# EasyEDA schematic G1000_Buttons_Right.json
TITLE: Sheet_1; REV: 1.0; Date: 2024-03-31; Sheet: 1/1; Drawn By: gagagu1; Company: Your Company
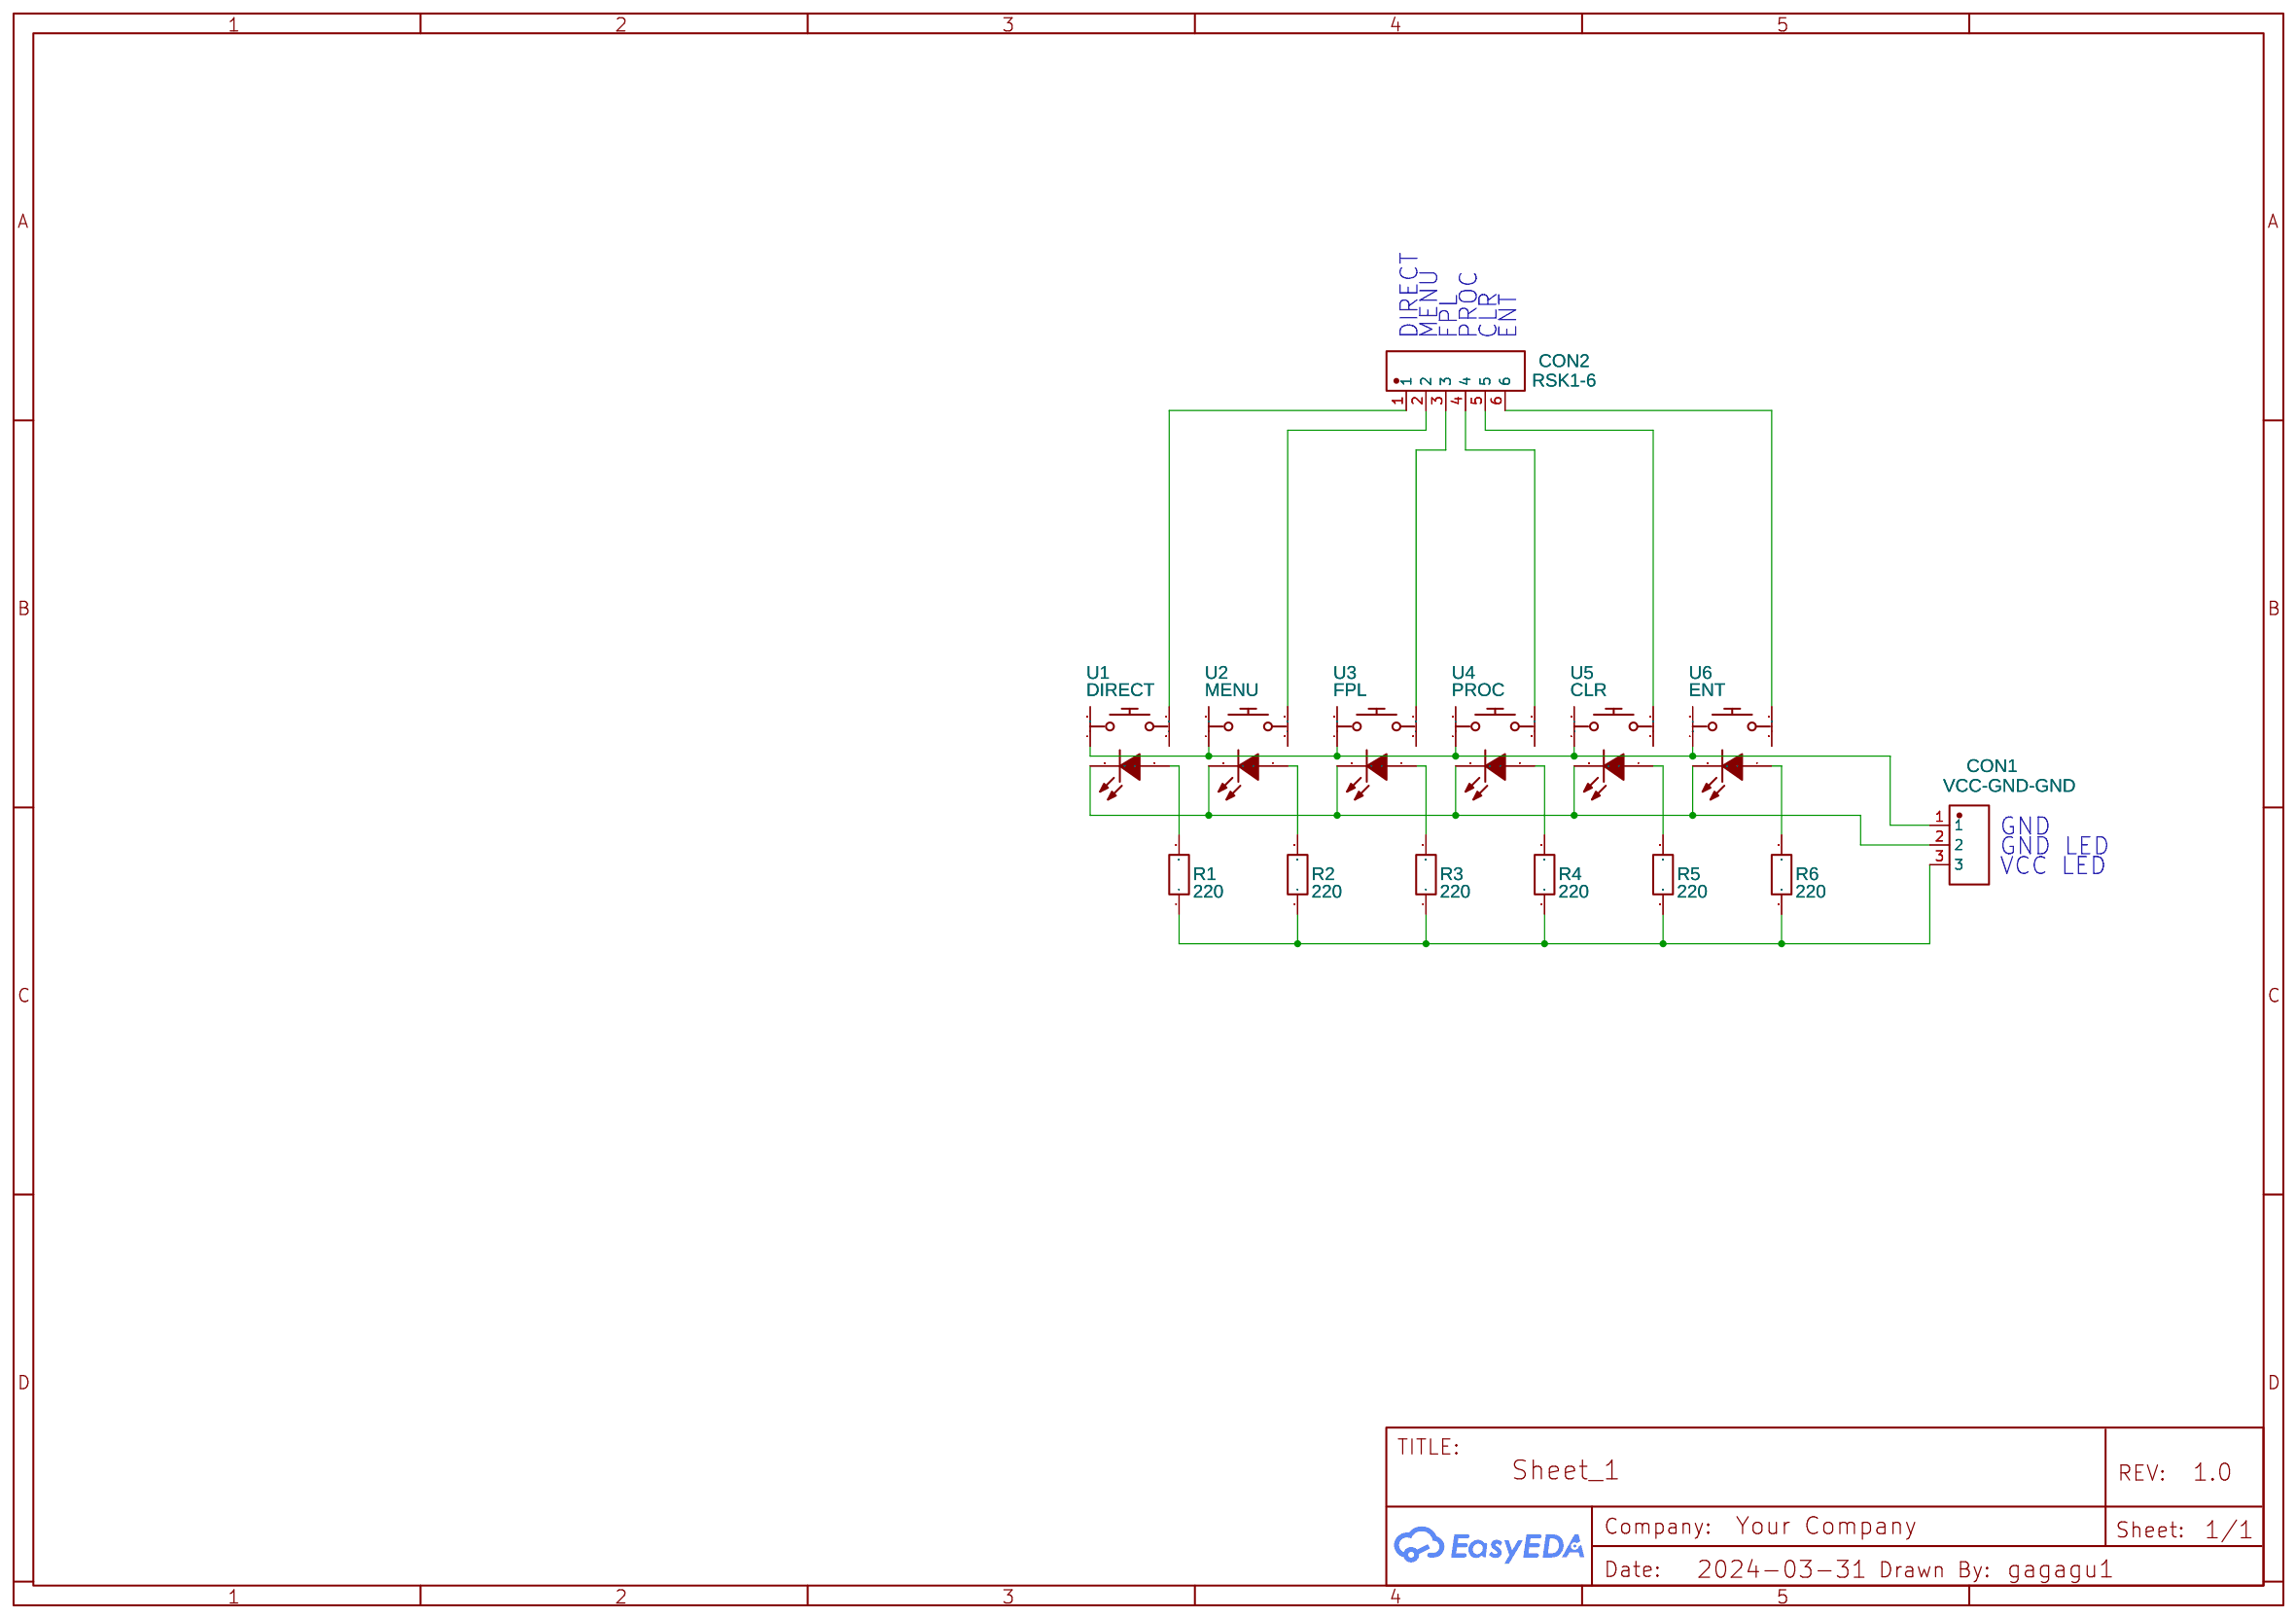
[diagram p0: schematic sheet]

## Parts
CON1  VCC-GND-GND  [CONN-TH_3P-P2.50_HC-XH-3A-G]
CON2  RSK1-6  [ARUN-CONN-TH_XH-6A]
R1  220  [R_AXIAL-0.4]
R2  220  [R_AXIAL-0.4]
R3  220  [R_AXIAL-0.4]
R4  220  [R_AXIAL-0.4]
R5  220  [R_AXIAL-0.4]
R6  220  [R_AXIAL-0.4]
U1  DIRECT  [6X6_LED+PUSHBUTTON]
U2  MENU  [6X6_LED+PUSHBUTTON]
U3  FPL  [6X6_LED+PUSHBUTTON]
U4  PROC  [6X6_LED+PUSHBUTTON]
U5  CLR  [6X6_LED+PUSHBUTTON]
U6  ENT  [6X6_LED+PUSHBUTTON]

## Library data of the parts
CON1 = HC-XH-3A-G: Contributor: Мэтт Милер; Supplier: LCSC; Supplier Part: C5341202; Manufacturer: HCTL(华灿天禄); JLCPCB Part Class: Extended Part
CON2 = ARUN-CONN-TH_XH-6A: Supplier: LCSC; Supplier Part: C722879; Manufacturer: CAX; Manufacturer Part: XH-6A; Contributor: LCSC; JLCPCB Part Class: Extended Part
R1-R6 = R_AXIAL-0.4_EU: Contributor: LCEDA_Lib
U1-U6 = 6X6_LED+PUSHBUTTON V2: sourceId: 5viSsqoYV; Contributor: Aleix Ferrero

## Nets
Net-(CON1-1): CON1.1 U1.4 U2.4 U3.4 U4.4 U5.4 U6.4
Net-(CON1-2): CON1.2 U1.C U2.C U3.C U4.C U5.C U6.C
Net-(CON1-3): CON1.3 R1.1 R2.1 R3.1 R4.1 R5.1 R6.1
Net-(CON2-1): CON2.1 U1.1
Net-(CON2-2): CON2.2 U2.1
Net-(CON2-3): CON2.3 U3.1
Net-(CON2-4): CON2.4 U4.1
Net-(CON2-5): CON2.5 U5.1
Net-(CON2-6): CON2.6 U6.1
Net-(R1-2): R1.2 U1.A
Net-(R2-2): R2.2 U2.A
Net-(R3-2): R3.2 U3.A
Net-(R4-2): R4.2 U4.A
Net-(R5-2): R5.2 U5.A
Net-(R6-2): R6.2 U6.A

Not connected (* = marked no-connect by the designer): U1 2 3; U2 2 3; U3 2 3; U4 2 3; U5 2 3; U6 2 3

## Notes on the sheet
- DIRECT
- MENU
- FPL
- PROC
- CLR
- ENT
- GND
- GND LED
- VCC LED
